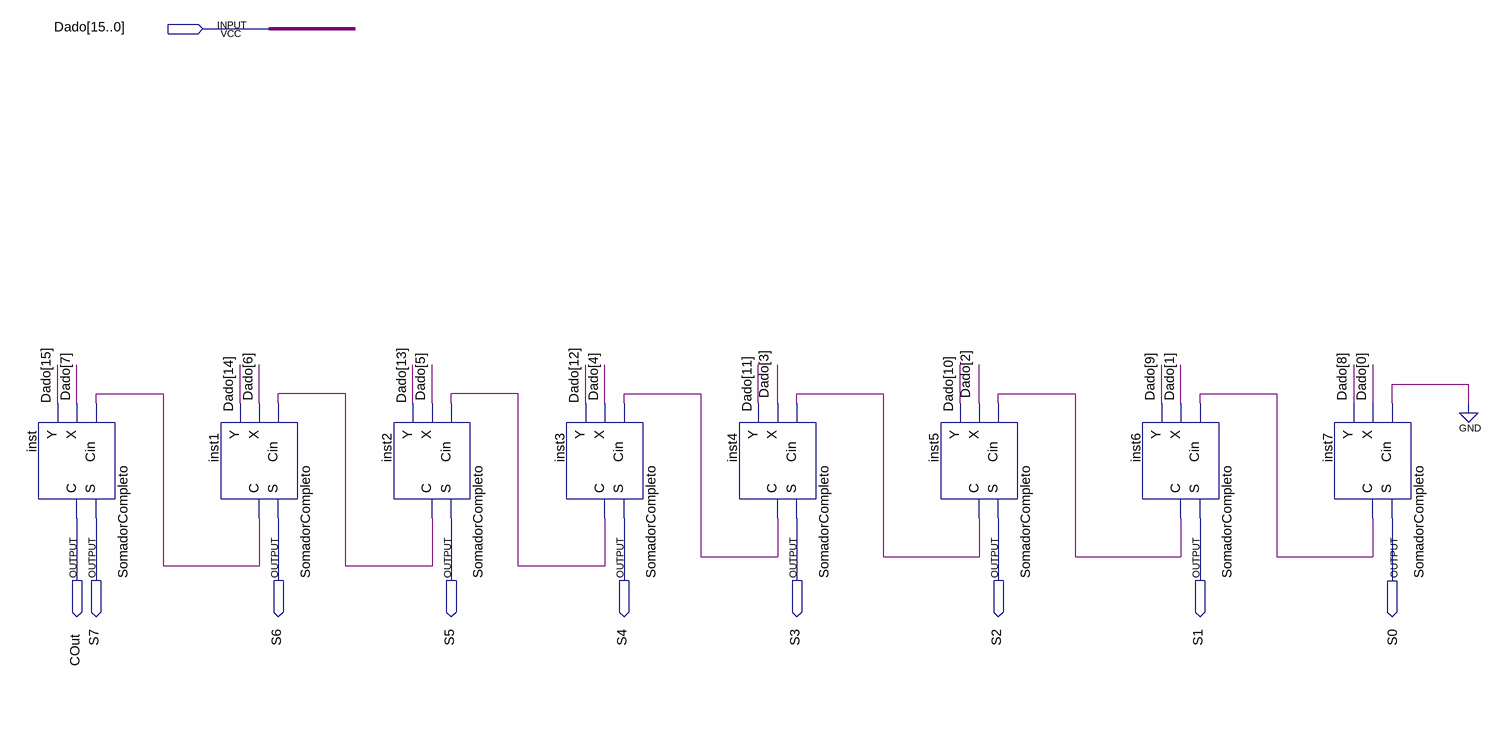
[diagram p0: schematic sheet]
// Quartus schematic Somador8Bits.bdf as structural Verilog: 8 symbols, 10 pins
module Somador8Bits (
  input  [15:0] Dado,
  output COut,
  output S7,
  output S6,
  output S5,
  output S4,
  output S3,
  output S2,
  output S1,
  output S0
);

  wire inst1_c, inst2_c, inst3_c, inst4_c, inst5_c, inst6_c, inst7_c;

  SomadorCompleto inst (.Cin(inst1_c), .X(Dado[7]), .Y(Dado[15]), .S(S7), .C(COut));
  SomadorCompleto inst1 (.Cin(inst2_c), .X(Dado[6]), .Y(Dado[14]), .S(S6), .C(inst1_c));
  SomadorCompleto inst2 (.Cin(inst3_c), .X(Dado[5]), .Y(Dado[13]), .S(S5), .C(inst2_c));
  SomadorCompleto inst3 (.Cin(inst4_c), .X(Dado[4]), .Y(Dado[12]), .S(S4), .C(inst3_c));
  SomadorCompleto inst4 (.Cin(inst5_c), .X(Dado[3]), .Y(Dado[11]), .S(S3), .C(inst4_c));
  SomadorCompleto inst5 (.Cin(inst6_c), .X(Dado[2]), .Y(Dado[10]), .S(S2), .C(inst5_c));
  SomadorCompleto inst6 (.Cin(inst7_c), .X(Dado[1]), .Y(Dado[9]), .S(S1), .C(inst6_c));
  SomadorCompleto inst7 (.Cin(1'b0), .X(Dado[0]), .Y(Dado[8]), .S(S0), .C(inst7_c));
endmodule
